# EAGLE schematic untitled (EAGLE 6.3)
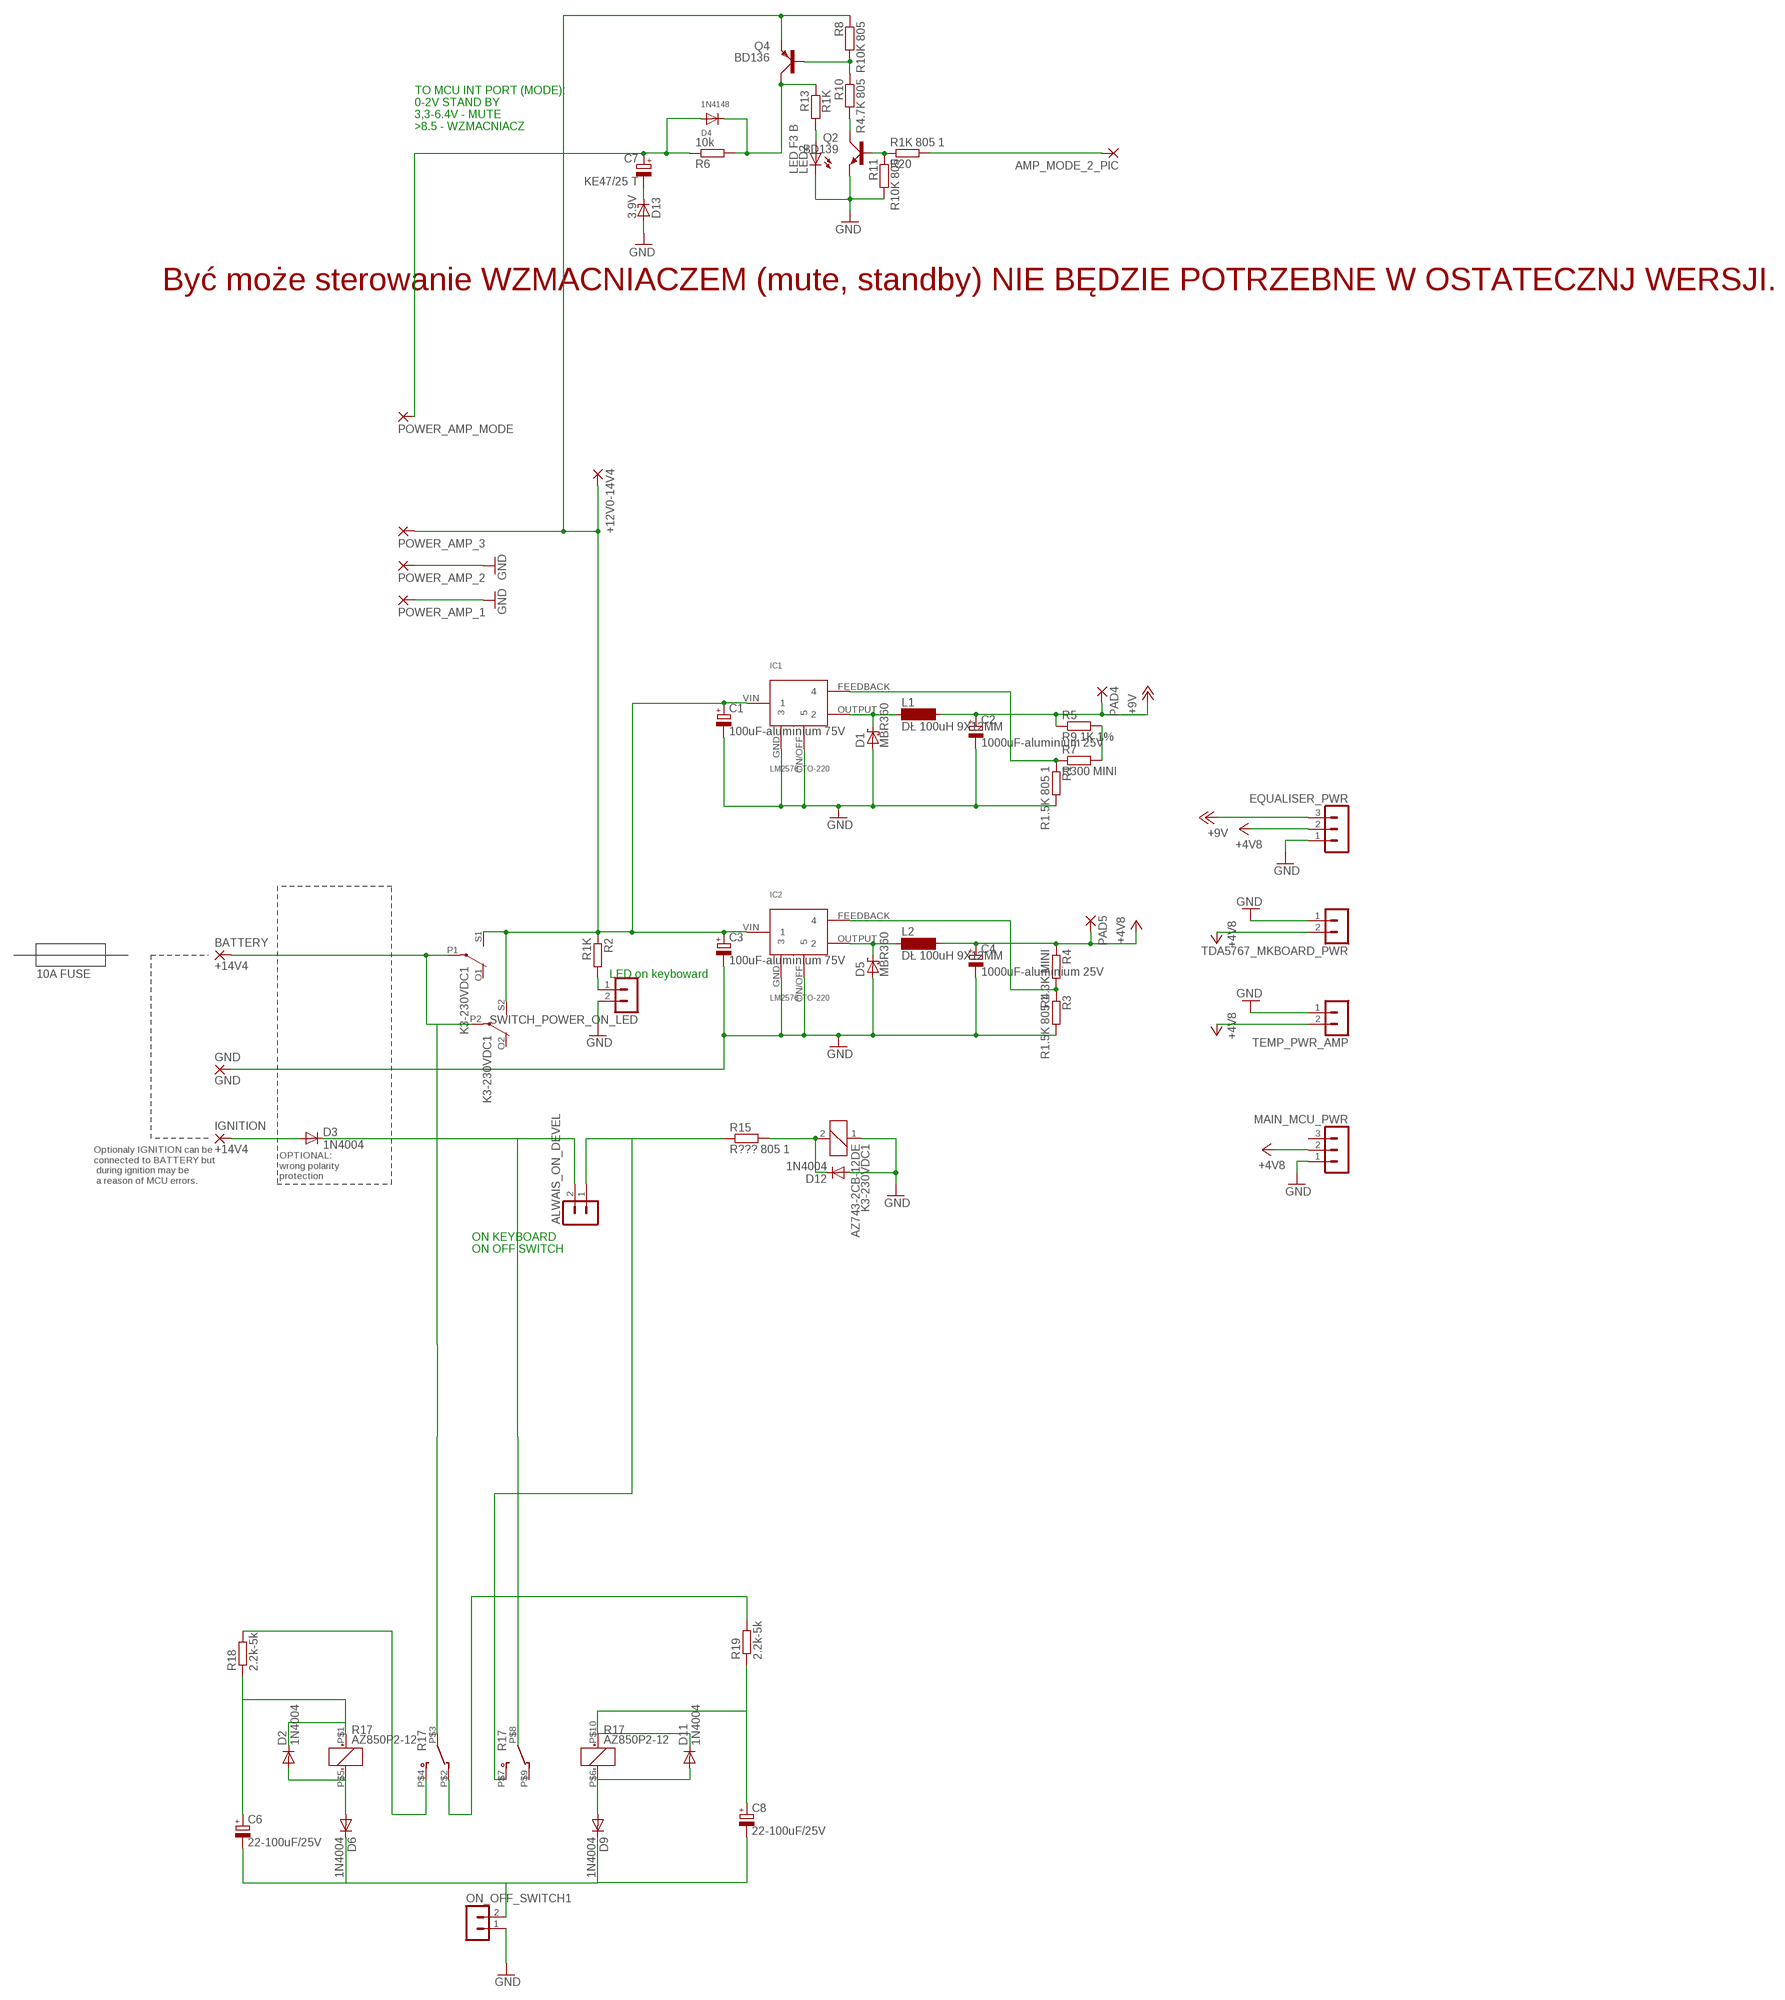
[diagram p0: schematic, sheet 1]

## Parts
+12V0-14V4  3,17/1,3  [3,17/1,3]
ALWAIS_ON_DEVEL  MA02-1  [MA02-1]
AMP_MODE_2_PIC  1,6/0,8  [1,6/0,8]
BATTERY  +14V4  3,81/1,3  [3,81/1,3]
C1  100uF-aluminium 75V  CPOL-EUE2.5-5V  [E2,5-4R]
C2  1000uF-aluminium 25V  CPOL-EUE2.5-5V  [E2,5-4R]
C3  100uF-aluminium 75V  CPOL-EUE2.5-5V  [E2,5-4R]
C4  1000uF-aluminium 25V  CPOL-EUE2.5-5V  [E2,5-4R]
C6  22-100uF/25V  CPOL-EUE2,5-6E  [E2,5-6E]
C7  KE47/25 T  CPOL-EUB45181A  [B45181A]
C8  22-100uF/25V  CPOL-EUE2,5-6E  [E2,5-6E]
D1  MBR360  SCHOTTKY-DIODEDO13M  [DO13M]
D2  1N4004  1N4004DO41-7.6  [DO41-7.6]
D3  1N4004  1N4004DO41-7.6  [DO41-7.6]
D4  1N4148  DIODEDO-1N4148  [DO-1N4148]
D5  MBR360  SCHOTTKY-DIODEDO13M  [DO13M]
D6  1N4004  1N4004DO41-7.6  [DO41-7.6]
D9  1N4004  1N4004DO41-7.6  [DO41-7.6]
D11  1N4004  1N4004DO41-7.6  [DO41-7.6]
D12  1N4004  1N4004DO41-7.6  [DO41-7.6]
D13  3.9V  ZENER-DIODEZD-5  [ZDIO-5]
EQUALISER_PWR  MA03-1  [MA03-1]
GND  GND  3,81/1,3  [3,81/1,3]
IC1  LM2576-TO-220  [TO220-5_STAGGERED]
IC2  LM2576-TO-220  [TO220-5_STAGGERED]
IGNITION  +14V4  3,81/1,3  [3,81/1,3]
K3-230VDC1  AZ743-2CB-12DE  G2R2  [G2R2]
L1  DŁ 100uH 9X12MM  BS11  [BS11]
L2  DŁ 100uH 9X12MM  BS11  [BS11]
LED2  LED F3 B  LED3MM  [LED3MM]
MAIN_MCU_PWR  MA03-1  [MA03-1]
ON_OFF_SWITCH1  MA02-1  [MA02-1]
PAD4  3,17/1,3  [3,17/1,3]
PAD5  3,17/1,3  [3,17/1,3]
POWER_AMP_1  3,17/1,3  [3,17/1,3]
POWER_AMP_2  3,17/1,3  [3,17/1,3]
POWER_AMP_3  3,17/1,3  [3,17/1,3]
POWER_AMP_MODE  3,17/1,3  [3,17/1,3]
Q2  BD139  [TO126AV]
Q4  BD136  BD140  [TO126AV]
R1  R1.5K 805 1  R-EU_M0805  [M0805]
R2  R1K  R-EU_0204/7  [0204/7]
R3  R1.5K 805 1  R-EU_M0805  [M0805]
R4  R4.3K MINI  R-EU_0204/5  [0204/5]
R5  R9.1K 1%  R-EU_0204/5  [0204/5]
R6  10k  R-EU_0204/5  [0204/5]
R7  R300 MINI  R-EU_0204/5  [0204/5]
R8  R10K 805  R-EU_R0805  [R0805]
R10  R4.7K 805  R-EU_R0805  [R0805]
R11  R10K 805  R-EU_R0805  [R0805]
R13  R1K  R-EU_0204/2V  [0204V]
R15  R??? 805 1  R-EU_M0805  [M0805]
R17  AZ850P2-12  [AZ850-2C]
R18  2.2k-5k  R-EU_0204/5  [0204/5]
R19  2.2k-5k  R-EU_0204/5  [0204/5]
R20  R1K 805 1  R-EU_R0805  [R0805]
SWITCH_POWER_ON_LED  MA02-1  [MA02-1]
TDA5767_MKBOARD_PWR  MA02-1  [MA02-1]
TEMP_PWR_AMP  MA02-1  [MA02-1]

## Nets
+4V8: C4.+ L2.2 PAD5.1(P) R4.1
+5V: EQUALISER_PWR.2 MAIN_MCU_PWR.2 TDA5767_MKBOARD_PWR.2 TEMP_PWR_AMP.2 ; supply symbol labelled +4V8
+9V0: C2.+ L1.2 PAD4.1(P) R5.1 ; supply symbol labelled +9V
+12V: EQUALISER_PWR.3 ; supply symbol labelled +9V
+14.4V: +12V0-14V4.1(P) C1.+ C3.+ IC1.VIN IC2.VIN K3-230VDC1.S1(2:S) K3-230VDC1.S2(3:S) POWER_AMP_3.1(P) Q4.E R2.1 R8.1
AMP_MODE: AMP_MODE_2_PIC.1(P) R20.2
GND: C1.- C2.- C3.- C4.- D1.A D5.A D12.A D13.A EQUALISER_PWR.1 GND.1(P) IC1.GND IC1.ON/OFF IC2.GND IC2.ON/OFF K3-230VDC1.1 LED2.K(C) MAIN_MCU_PWR.1 ON_OFF_SWITCH1.1 POWER_AMP_1.1(P) POWER_AMP_2.1(P) Q2.E R1.2 R3.2 R11.2 SWITCH_POWER_ON_LED.2 TDA5767_MKBOARD_PWR.1 TEMP_PWR_AMP.1
IGNITION: D3.A IGNITION.1(P)
MCLR_SUPPLY: ALWAIS_ON_DEVEL.2 D3.C
N$2: BATTERY.1(P) K3-230VDC1.P1(2:P) K3-230VDC1.P2(3:P) R17.P$3
N$3: D2.A D6.A R17.P$5(S$1:-)
N$5: D4.C Q4.C R6.2 R13.1
N$6: D12.C K3-230VDC1.2 R15.2
N$7: D1.C IC1.OUTPUT L1.1
N$8: IC1.FEEDBACK R1.1 R7.1
N$9: D5.C IC2.OUTPUT L2.1
N$10: IC2.FEEDBACK R3.1 R4.2
N$11: R5.2 R7.2
N$13: R2.2 SWITCH_POWER_ON_LED.1
N$16: ALWAIS_ON_DEVEL.1 R15.1 R17.P$7
N$17: D2.C
N$20: C8.+ D11.C R17.P$10(R$2:+) R19.1
N$21: C7.- D13.C
N$22: C6.- C8.- D6.C D9.C ON_OFF_SWITCH1.2
N$23: C7.+ D4.A POWER_AMP_MODE.1(P) R6.1
N$24: C6.+ R17.P$1(S$1:+) R18.1
N$27: D9.A D11.A R17.P$6(R$2:-)
N$30: R17.P$4 R18.2
N$31: R17.P$2 R19.2
N$47: Q2.B R11.1 R20.1
N$48: Q2.C R10.2
N$49: Q4.B R8.2 R10.1
N$52: LED2.A R13.2
Unconnected: K3-230VDC1.O1(2:O) K3-230VDC1.O2(3:O) MAIN_MCU_PWR.3 R17.P$8 R17.P$9

## Notes on the sheet
- TO MCU INT PORT (MODE): 
  0-2V STAND BY
  3,3-6.4V - MUTE
  >8.5 - WZMACNIACZ
- Być może sterowanie WZMACNIACZEM (mute, standby) NIE BĘDZIE POTRZEBNE W OSTATECZNJ WERSJI.
- 10A FUSE | LED on keyboward
- OPTIONAL:
  wrong polarity
  protection
- Optionaly IGNITION can be
  connected to BATTERY but
   during ignition may be
   a reason of MCU errors.
- ON KEYBOARD
  ON OFF SWITCH

## Library data of the parts
+12V0-14V4 PAD4 PAD5 POWER_AMP_1-POWER_AMP_3 POWER_AMP_MODE = wirepad:3,17/1,3: THROUGH-HOLE PAD
ALWAIS_ON_DEVEL ON_OFF_SWITCH1 SWITCH_POWER_ON_LED TDA5767_MKBOARD_PWR TEMP_PWR_AMP = con-lstb_SileliS:MA02-1: PIN HEADER
AMP_MODE_2_PIC = wirepad:1,6/0,8: THROUGH-HOLE PAD
BATTERY GND IGNITION = wirepad:3,81/1,3: THROUGH-HOLE PAD
C1-C4 C7 = rcl:CPOL-EU: POLARIZED CAPACITOR, European symbol
C6 C8 = resistor:CPOL-EU: POLARIZED CAPACITOR, European symbol
D1 D5 = adafruit:SCHOTTKY-DIODE: Schottky Diode
D2 D3 D6 D9 D11 D12 = diode_SileliS:1N4004: DIODE general purpose rectifier, 1 A
D4 = adafruit:DIODE: Diode SMADIODE - SMA Surface Mount Package 20V 1A Schottky Diode Digikey: 641-1014-6-ND DO-1N4148 - Through Hole Small Current Diode SOD-123 20V 1 A (.5mV Vf) Schottky Diode - Digikey: MBRX120TPMSCT-ND SOD-323 10V 570mA (.38mV Vf, 3ns) Schottky Diode - Digikey: ZLLS410CT-ND SOD-523 30V 30mA Schottky Diode (RB751S-40TE61) - Digikey: RB751S-40TE61CT-ND SOT23-R/W - SOT23 Package (R = Solder Paste/Reflow Ovens, W = Hand-Soldering) BAT54Film 40V 300mA - Digikey: 497-7162-1-ND
D13 = diode:ZENER-DIODE: Z-Diode
EQUALISER_PWR MAIN_MCU_PWR = con-lstb_SileliS:MA03-1: PIN HEADER; OC_FARNELL: unknown; OC_NEWARK: unknown
IC1 IC2 = LM2576:LM2576-TO-220
K3-230VDC1 = relay:G2R2: RELAY 2 x switch, Omron; MF: OMRON COMPONENTS USA; MPN: G2R-2-DC6; OC_FARNELL: unknown; OC_NEWARK: 89C5317
L1 L2 = inductor-neosid:BS: INDUCTOR nominal inductance, magnetically screened; OC_FARNELL: unknown; OC_NEWARK: unknown
LED2 = led:LED: LED OSRAM: - CHIPLED LG R971, LG N971, LY N971, LG Q971, LY Q971, LO R971, LY R971 LH N974, LH R974 LS Q976, LO Q976, LY Q976 LO Q996 - Hyper CHIPLED LW Q18S LB Q993, LB Q99A, LB R99A - SideLED LS A670, LO A670, LY A670, LG A670, LP A670 LB A673, LV A673, LT A673, LW A673 LH A674 LY A675 LS A676, LA A676, LO A676, LY A676, LW A676 LS A679, LY A679, LG A679 - Hyper Micro SIDELED® LS Y876, LA Y876, LO Y876, LY Y876 LT Y87S - SmartLED LW L88C, LW L88S LB L89C, LB L89S, LG L890 LS L89K, LO L89K, LY L89K LS L896, LA L896, LO L896, LY L896 - TOPLED LS T670, LO T670, LY T670, LG T670, LP T670 LSG T670, LSP T670, LSY T670, LOP T670, LYG T670 LG T671, LOG T671, LSG T671 LB T673, LV T673, LT T673, LW T673 LH T674 LS T676, LA T676, LO T676, LY T676, LB T676, LH T676, LSB T676, LW T676 LB T67C, LV T67C, LT T67C, LS T67K, LO T67K, LY T67K, LW E67C LS E67B, LA E67B, LO E67B, LY E67B, LB E67C, LV E67C, LT E67C LW T67C LS T679, LY T679, LG T679 LS T770, LO T770, LY T770, LG T770, LP T770 LB T773, LV T773, LT T773, LW T773 LH T774 LS E675, LA E675, LY E675, LS T675 LS T776, LA T776, LO T776, LY T776, LB T776 LHGB T686 LT T68C, LB T68C - Hyper Mini TOPLED® LB M676 - Mini TOPLED Santana® LG M470 LS M47K, LO M47K, LY M47K Source: http://www.osram.convergy.de LUXEON: - LUMILED® LXK2-PW12-R00, LXK2-PW12-S00, LXK2-PW14-U00, LXK2-PW14-V00 LXK2-PM12-R00, LXK2-PM12-S00, LXK2-PM14-U00 LXK2-PE12-Q00, LXK2-PE12-R00, LXK2-PE12-S00, LXK2-PE14-T00, LXK2-PE14-U00 LXK2-PB12-K00, LXK2-PB12-L00, LXK2-PB12-M00, LXK2-PB14-N00, LXK2-PB14-P00, LXK2-PB14-Q00 LXK2-PR12-L00, LXK2-PR12-M00, LXK2-PR14-Q00, LXK2-PR14-R00 LXK2-PD12-Q00, LXK2-PD12-R00, LXK2-PD12-S00 LXK2-PH12-R00, LXK2-PH12-S00 LXK2-PL12-P00, LXK2-PL12-Q00, LXK2-PL12-R00 Source: www.luxeon.com KINGBRIGHT: KA-3528ASYC Source: www.kingbright.com
Q2 = transistor-power:BD139: NPN TRANSISTOR
Q4 = transistor-power:BD140: PNP TRANSISTOR
R1-R8 R10 R11 R13 R15 R20 = rcl:R-EU_: RESISTOR, European symbol
R17 = relay_silelis:AZ850P2-12
R18 R19 = resistor:R-EU_: RESISTOR, European symbol